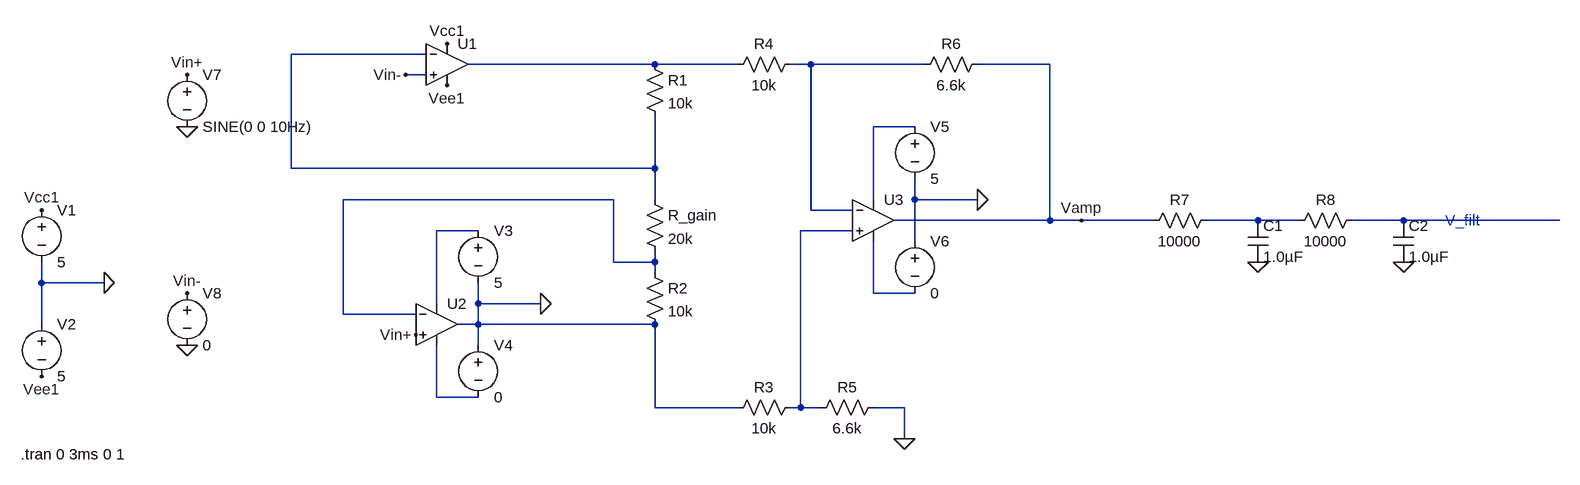
[diagram p0: schematic LT_SPICE_JPT_131_2.asc]
LT_SPICE_JPT_131_2.asc, the LTspice schematic file:
Version 4
SHEET 1 1588 712
WIRE -2192 -32 -2400 -32
WIRE -1840 -16 -2128 -16
WIRE -1712 -16 -1840 -16
WIRE -1600 -16 -1632 -16
WIRE -1424 -16 -1600 -16
WIRE -1232 -16 -1344 -16
WIRE -2192 0 -2224 0
WIRE -1440 80 -1504 80
WIRE -2400 144 -2400 -32
WIRE -1840 144 -1840 64
WIRE -1840 144 -2400 144
WIRE -1904 192 -2320 192
WIRE -1840 192 -1840 144
WIRE -1504 192 -1504 80
WIRE -1440 192 -1440 160
WIRE -1344 192 -1440 192
WIRE -1600 208 -1600 -16
WIRE -1536 208 -1600 208
WIRE -1232 224 -1232 -16
WIRE -1232 224 -1472 224
WIRE -1184 224 -1232 224
WIRE -1072 224 -1184 224
WIRE -912 224 -992 224
WIRE -848 224 -912 224
WIRE -688 224 -768 224
WIRE -448 224 -688 224
WIRE -2112 240 -2176 240
WIRE -1536 240 -1616 240
WIRE -1440 256 -1440 192
WIRE -1904 288 -1904 192
WIRE -1840 288 -1840 272
WIRE -1840 288 -1904 288
WIRE -1840 304 -1840 288
WIRE -2784 320 -2784 288
WIRE -2688 320 -2784 320
WIRE -1504 336 -1504 256
WIRE -1440 336 -1504 336
WIRE -2176 352 -2176 240
WIRE -2112 352 -2112 320
WIRE -2016 352 -2112 352
WIRE -2320 368 -2320 192
WIRE -2208 368 -2320 368
WIRE -2784 384 -2784 320
WIRE -2112 384 -2112 352
WIRE -2112 384 -2144 384
WIRE -1840 384 -2112 384
WIRE -2112 416 -2112 384
WIRE -2176 496 -2176 416
WIRE -2112 496 -2176 496
WIRE -1840 512 -1840 384
WIRE -1712 512 -1840 512
WIRE -1616 512 -1616 240
WIRE -1616 512 -1632 512
WIRE -1584 512 -1616 512
WIRE -1456 512 -1504 512
WIRE -1456 560 -1456 512
FLAG -1456 560 0
FLAG -2688 320 0
FLAG -2016 352 0
FLAG -1344 192 0
FLAG -912 288 0
FLAG -688 288 0
FLAG -1184 224 Vamp
FLAG -2160 -48 Vcc1
FLAG -2784 208 Vcc1
FLAG -2160 16 Vee1
FLAG -2784 464 Vee1
FLAG -2224 0 Vin-
FLAG -2208 400 Vin+
FLAG -2560 0 Vin+
FLAG -2560 336 Vin-
FLAG -2560 80 0
FLAG -2560 416 0
SYMBOL OpAmps\\UniversalOpAmp2 -2160 -16 R0
SYMATTR InstName U1
SYMATTR Value2 Avol=1e6 GBW=350000 Slew=0.3
SYMATTR SpiceLine Ilimit=0.005 Rail=1 Vos=1u
SYMATTR SpiceLine2 En=0.000045 Enk=1 In=.00025 Ink=1 Rin=1e9
SYMBOL res -1856 -32 R0
SYMATTR InstName R1
SYMATTR Value 10k
SYMBOL res -1856 176 R0
SYMATTR InstName R_gain
SYMATTR Value 20k
SYMBOL OpAmps\\UniversalOpAmp2 -2176 384 R0
SYMATTR InstName U2
SYMATTR Value2 Avol=1e6 GBW=350000 Slew=0.3
SYMATTR SpiceLine Ilimit=0.005 Rail=1 Vos=1u
SYMATTR SpiceLine2 En=0.000045 Enk=1 In=0.00025 Ink=1 Rin=1e9
SYMBOL res -1856 288 R0
SYMATTR InstName R2
SYMATTR Value 10k
SYMBOL res -1616 496 R90
WINDOW 0 0 56 VBottom 2
WINDOW 3 32 56 VTop 2
SYMATTR InstName R3
SYMATTR Value 10k
SYMBOL res -1616 -32 R90
WINDOW 0 0 56 VBottom 2
WINDOW 3 32 56 VTop 2
SYMATTR InstName R4
SYMATTR Value 10k
SYMBOL OpAmps\\UniversalOpAmp2 -1504 224 R0
SYMATTR InstName U3
SYMATTR Value2 Avol=1e6 GBW=350000 Slew=0.3
SYMATTR SpiceLine Ilimit=0.005 Rail=1 Vos=1u
SYMATTR SpiceLine2 En=0.000045 Enk=1 In=0.00025 Ink=1 Rin=1e9
SYMBOL res -1488 496 R90
WINDOW 0 0 56 VBottom 2
WINDOW 3 32 56 VTop 2
SYMATTR InstName R5
SYMATTR Value 6.6k
SYMBOL res -1328 -32 R90
WINDOW 0 0 56 VBottom 2
WINDOW 3 32 56 VTop 2
SYMATTR InstName R6
SYMATTR Value 6.6k
SYMBOL voltage -2784 192 R0
WINDOW 123 0 0 Left 0
WINDOW 39 0 0 Left 0
SYMATTR InstName V1
SYMATTR Value 5
SYMBOL voltage -2784 368 R0
WINDOW 123 0 0 Left 0
WINDOW 39 0 0 Left 0
SYMATTR InstName V2
SYMATTR Value 5
SYMBOL voltage -2112 224 R0
WINDOW 123 0 0 Left 0
WINDOW 39 0 0 Left 0
SYMATTR InstName V3
SYMATTR Value 5
SYMBOL voltage -2112 400 R0
WINDOW 123 0 0 Left 0
WINDOW 39 0 0 Left 0
SYMATTR InstName V4
SYMATTR Value 0
SYMBOL voltage -1440 64 R0
WINDOW 123 0 0 Left 0
WINDOW 39 0 0 Left 0
SYMATTR InstName V5
SYMATTR Value 5
SYMBOL voltage -1440 240 R0
WINDOW 123 0 0 Left 0
WINDOW 39 0 0 Left 0
SYMATTR InstName V6
SYMATTR Value 0
SYMBOL res -976 208 R90
WINDOW 0 0 56 VBottom 2
WINDOW 3 32 56 VTop 2
SYMATTR InstName R7
SYMATTR Value 10000
SYMBOL res -752 208 R90
WINDOW 0 0 56 VBottom 2
WINDOW 3 32 56 VTop 2
SYMATTR InstName R8
SYMATTR Value 10000
SYMBOL cap -928 224 R0
SYMATTR InstName C1
SYMATTR Value 1.0µF
SYMBOL cap -704 224 R0
SYMATTR InstName C2
SYMATTR Value 1.0µF
SYMBOL voltage -2560 -16 R0
WINDOW 123 0 0 Left 0
WINDOW 39 0 0 Left 0
SYMATTR InstName V7
SYMATTR Value SINE(0 0 10Hz)
SYMBOL voltage -2560 320 R0
SYMATTR InstName V8
SYMATTR Value 0
TEXT -624 224 Left 2 ;V_filt
TEXT -2816 584 Left 2 !.tran 0 3ms 0 1

The netlist it stands for:
* LT_SPICE_JPT_131_2.asc
XU1 Vin- N001 Vcc1 Vee1 N002 level2 Avol=1e6 GBW=350000 Slew=0.3 Ilimit=0.005 Rail=1 Vos=1u En=0.000045 Enk=1 In=.00025 Ink=1 Rin=1e9  ; pins In+ In- V+ V- OUT
R1 N002 N001 10k
R_gain N001 N005 20k
XU2 Vin+ N005 N008 N011 0 level2 Avol=1e6 GBW=350000 Slew=0.3 Ilimit=0.005 Rail=1 Vos=1u En=0.000045 Enk=1 In=0.00025 Ink=1 Rin=1e9  ; pins In+ In- V+ V- OUT
R2 N005 0 10k
R3 N009 0 10k
R4 N003 N002 10k
XU3 N009 N003 N004 N010 Vamp level2 Avol=1e6 GBW=350000 Slew=0.3 Ilimit=0.005 Rail=1 Vos=1u En=0.000045 Enk=1 In=0.00025 Ink=1 Rin=1e9  ; pins In+ In- V+ V- OUT
R5 0 N009 6.6k
R6 Vamp N003 6.6k
V1 Vcc1 0 5
V2 0 Vee1 5
V3 N008 0 5
V4 0 N011 0
V5 N004 0 5
V6 0 N010 0
R7 N006 Vamp 10000
R8 N007 N006 10000
C1 N006 0 1.0µF
C2 N007 0 1.0µF
V7 Vin+ 0 SINE(0 0 10Hz)
V8 Vin- 0 0
* V_filt
.tran 0 3ms 0 1
.lib UniversalOpAmp2.lib
.backanno
.end